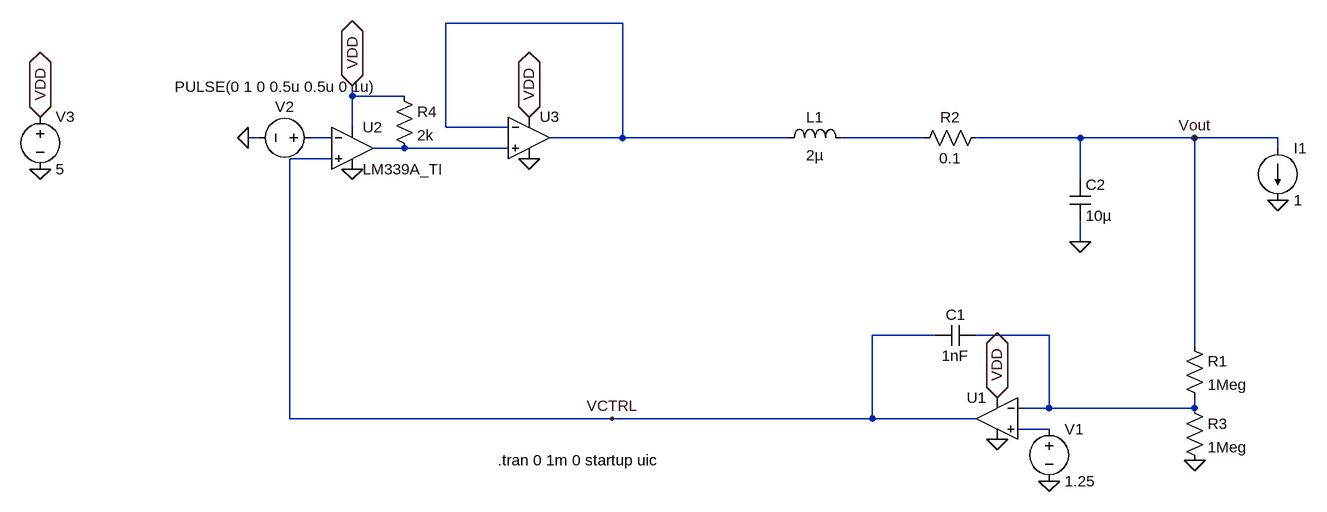
[diagram p0: schematic tut7ques8b.asc]
tut7ques8b.asc, the LTspice schematic file:
Version 4
SHEET 1 880 680
WIRE -528 -432 -800 -432
WIRE -944 -320 -944 -336
WIRE -864 -320 -944 -320
WIRE -944 -272 -944 -320
WIRE -800 -272 -800 -432
WIRE -704 -272 -800 -272
WIRE -1088 -256 -1104 -256
WIRE -976 -256 -1008 -256
WIRE -528 -256 -528 -432
WIRE -528 -256 -640 -256
WIRE -272 -256 -528 -256
WIRE -64 -256 -192 -256
WIRE 176 -256 16 -256
WIRE 352 -256 176 -256
WIRE 480 -256 352 -256
WIRE -864 -240 -912 -240
WIRE -704 -240 -864 -240
WIRE 480 -240 480 -256
WIRE -976 -224 -1040 -224
WIRE 176 -192 176 -256
WIRE 176 -96 176 -128
WIRE -48 48 -144 48
WIRE 128 48 16 48
WIRE 352 64 352 -256
WIRE 128 160 128 48
WIRE 128 160 80 160
WIRE 352 160 352 144
WIRE 352 160 128 160
WIRE -1040 176 -1040 -224
WIRE -544 176 -1040 176
WIRE -144 176 -144 48
WIRE -144 176 -544 176
WIRE 16 176 -144 176
WIRE 128 192 80 192
FLAG 176 -96 0
FLAG 352 240 0
FLAG -1104 -256 0
FLAG 480 -160 0
FLAG -944 -208 0
FLAG -1424 -208 0
FLAG -1424 -288 VDD
IOPIN -1424 -288 BiDir
FLAG -672 -224 0
FLAG 48 208 0
FLAG -672 -288 VDD
IOPIN -672 -288 BiDir
FLAG -944 -336 VDD
IOPIN -944 -336 BiDir
FLAG 48 144 VDD
IOPIN 48 144 BiDir
FLAG 128 272 0
FLAG -544 176 VCTRL
FLAG 352 -256 Vout
SYMBOL res 336 48 R0
SYMATTR InstName R1
SYMATTR Value 1Meg
SYMBOL cap 16 32 R90
WINDOW 0 0 32 VBottom 2
WINDOW 3 32 32 VTop 2
SYMATTR InstName C1
SYMATTR Value 1nF
SYMBOL ind -288 -240 R270
WINDOW 0 32 56 VTop 2
WINDOW 3 5 56 VBottom 2
SYMATTR InstName L1
SYMATTR Value 2µ
SYMBOL res 32 -272 R90
WINDOW 0 0 56 VBottom 2
WINDOW 3 32 56 VTop 2
SYMATTR InstName R2
SYMATTR Value 0.1
SYMBOL cap 160 -192 R0
SYMATTR InstName C2
SYMATTR Value 10µ
SYMBOL OpAmps\\UniversalOpAmp 48 176 M0
SYMATTR InstName U1
SYMBOL OpAmps\\UniversalOpAmp -672 -256 R0
SYMATTR InstName U3
SYMBOL res 336 144 R0
SYMATTR InstName R3
SYMATTR Value 1Meg
SYMBOL ZZZ\\Comparator\\LM339A_TI -944 -240 R0
SYMATTR InstName U2
SYMBOL voltage -992 -256 R90
WINDOW 0 -32 56 VBottom 2
WINDOW 3 -94 70 VTop 2
WINDOW 123 0 0 Left 0
WINDOW 39 0 0 Left 0
SYMATTR InstName V2
SYMATTR Value PULSE(0 1 0 0.5u 0.5u 0 1u)
SYMBOL current 480 -240 R0
WINDOW 123 0 0 Left 0
WINDOW 39 0 0 Left 0
SYMATTR InstName I1
SYMATTR Value 1
SYMBOL voltage -1424 -304 R0
SYMATTR InstName V3
SYMATTR Value 5
SYMBOL voltage 128 176 R0
WINDOW 123 0 0 Left 0
WINDOW 39 0 0 Left 0
SYMATTR InstName V1
SYMATTR Value 1.25
SYMBOL res -880 -336 R0
SYMATTR InstName R4
SYMATTR Value 2k
TEXT -720 240 Left 2 !.tran 0 1m 0 startup uic

The netlist it stands for:
* tut7ques8b.asc
R1 Vout N005 1Meg
C1 N005 VCTRL 1nF
L1 N001 N003 2µ
R2 Vout N003 0.1
C2 Vout 0 10µ
XU1 N006 N005 VDD 0 VCTRL level1 Avol=1Meg GBW=10Meg Vos=0 En=0 Enk=0 In=0 Ink=0 Rin=500Meg  ; pins In+ In- V+ V- OUT
XU3 N004 N001 VDD 0 N001 level1 Avol=1Meg GBW=10Meg Vos=0 En=0 Enk=0 In=0 Ink=0 Rin=500Meg  ; pins In+ In- V+ V- OUT
R3 N005 0 1Meg
* U2: LM339A_TI (symbol ZZZ\Comparator\LM339A_TI not available, pins judged from their places): In+=VCTRL In-=N002 V+=VDD V-=0 OUT=N004
V2 N002 0 PULSE(0 1 0 0.5u 0.5u 0 1u)
I1 Vout 0 1
V3 VDD 0 5
V1 N006 0 1.25
R4 VDD N004 2k
.tran 0 1m 0 startup uic
.lib UniversalOpAmp1.lib
.backanno
.end